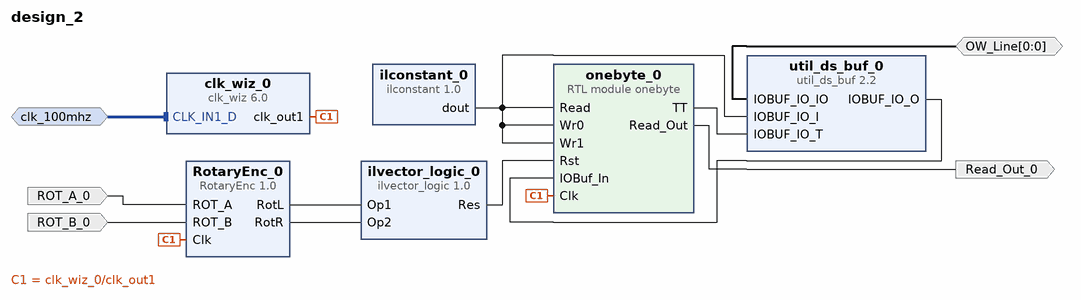
[diagram p0: block diagram of the top level]
# Vivado block design design_2, xczu3eg-sfvc784-2-e, Vivado 2025.1
create_bd_design design_2

create_bd_intf_port -mode Slave -vlnv xilinx.com:interface:diff_clock_rtl:1.0 clk_100mhz
set_property -dict {CONFIG.FREQ_HZ 100000000} [get_bd_intf_ports clk_100mhz]
create_bd_port -dir O Read_Out_0
create_bd_port -dir I ROT_A_0
create_bd_port -dir I ROT_B_0
create_bd_port -dir IO -from 0 -to 0 OW_Line

create_bd_cell -type module -reference onebyte onebyte_0
create_bd_cell -type ip -vlnv JS_WUST:UCiSW:RotaryEnc:1.0 RotaryEnc_0
create_bd_cell -type inline_hdl -vlnv xilinx.com:inline_hdl:ilvector_logic:1.0 ilvector_logic_0
set_property -dict {CONFIG.C_SIZE 1} [get_bd_cells ilvector_logic_0]
create_bd_cell -type ip -vlnv xilinx.com:ip:clk_wiz:6.0 clk_wiz_0
set_property -dict {CONFIG.CLK_IN1_BOARD_INTERFACE clk_100mhz CONFIG.USE_BOARD_FLOW true} [get_bd_cells clk_wiz_0]
create_bd_cell -type ip -vlnv xilinx.com:ip:util_ds_buf:2.2 util_ds_buf_0
set_property -dict {CONFIG.C_BUF_TYPE IOBUF} [get_bd_cells util_ds_buf_0]
create_bd_cell -type inline_hdl -vlnv xilinx.com:inline_hdl:ilconstant:1.0 ilconstant_0
set_property -dict {CONFIG.CONST_VAL 0} [get_bd_cells ilconstant_0]

# ---- connections ----

connect_bd_intf_net [get_bd_intf_ports clk_100mhz] [get_bd_intf_pins clk_wiz_0/CLK_IN1_D]
connect_bd_net [get_bd_ports OW_Line] [get_bd_pins util_ds_buf_0/IOBUF_IO_IO]
connect_bd_net -net ROT_A_0_1 [get_bd_ports ROT_A_0] [get_bd_pins RotaryEnc_0/ROT_A]
connect_bd_net -net ROT_B_0_1 [get_bd_ports ROT_B_0] [get_bd_pins RotaryEnc_0/ROT_B]
connect_bd_net [get_bd_pins RotaryEnc_0/RotL] [get_bd_pins ilvector_logic_0/Op1]
connect_bd_net [get_bd_pins RotaryEnc_0/RotR] [get_bd_pins ilvector_logic_0/Op2]
connect_bd_net [get_bd_pins clk_wiz_0/clk_out1] [get_bd_pins RotaryEnc_0/Clk] [get_bd_pins onebyte_0/Clk]
connect_bd_net [get_bd_pins ilconstant_0/dout] \
  [get_bd_pins util_ds_buf_0/IOBUF_IO_I] [get_bd_pins onebyte_0/Wr1] [get_bd_pins onebyte_0/Wr0] [get_bd_pins onebyte_0/Read]
connect_bd_net [get_bd_pins ilvector_logic_0/Res] [get_bd_pins onebyte_0/Rst]
connect_bd_net [get_bd_pins onebyte_0/Read_Out] [get_bd_ports Read_Out_0]
connect_bd_net [get_bd_pins onebyte_0/TT] [get_bd_pins util_ds_buf_0/IOBUF_IO_T]
connect_bd_net [get_bd_pins util_ds_buf_0/IOBUF_IO_O] [get_bd_pins onebyte_0/IOBuf_In]

validate_bd_design
save_bd_design
